# EasyEDA Pro project Robotic_Arm.eprj

# Schematic Schematic1
Board Name: Board1; Create Date: 2024-09-22
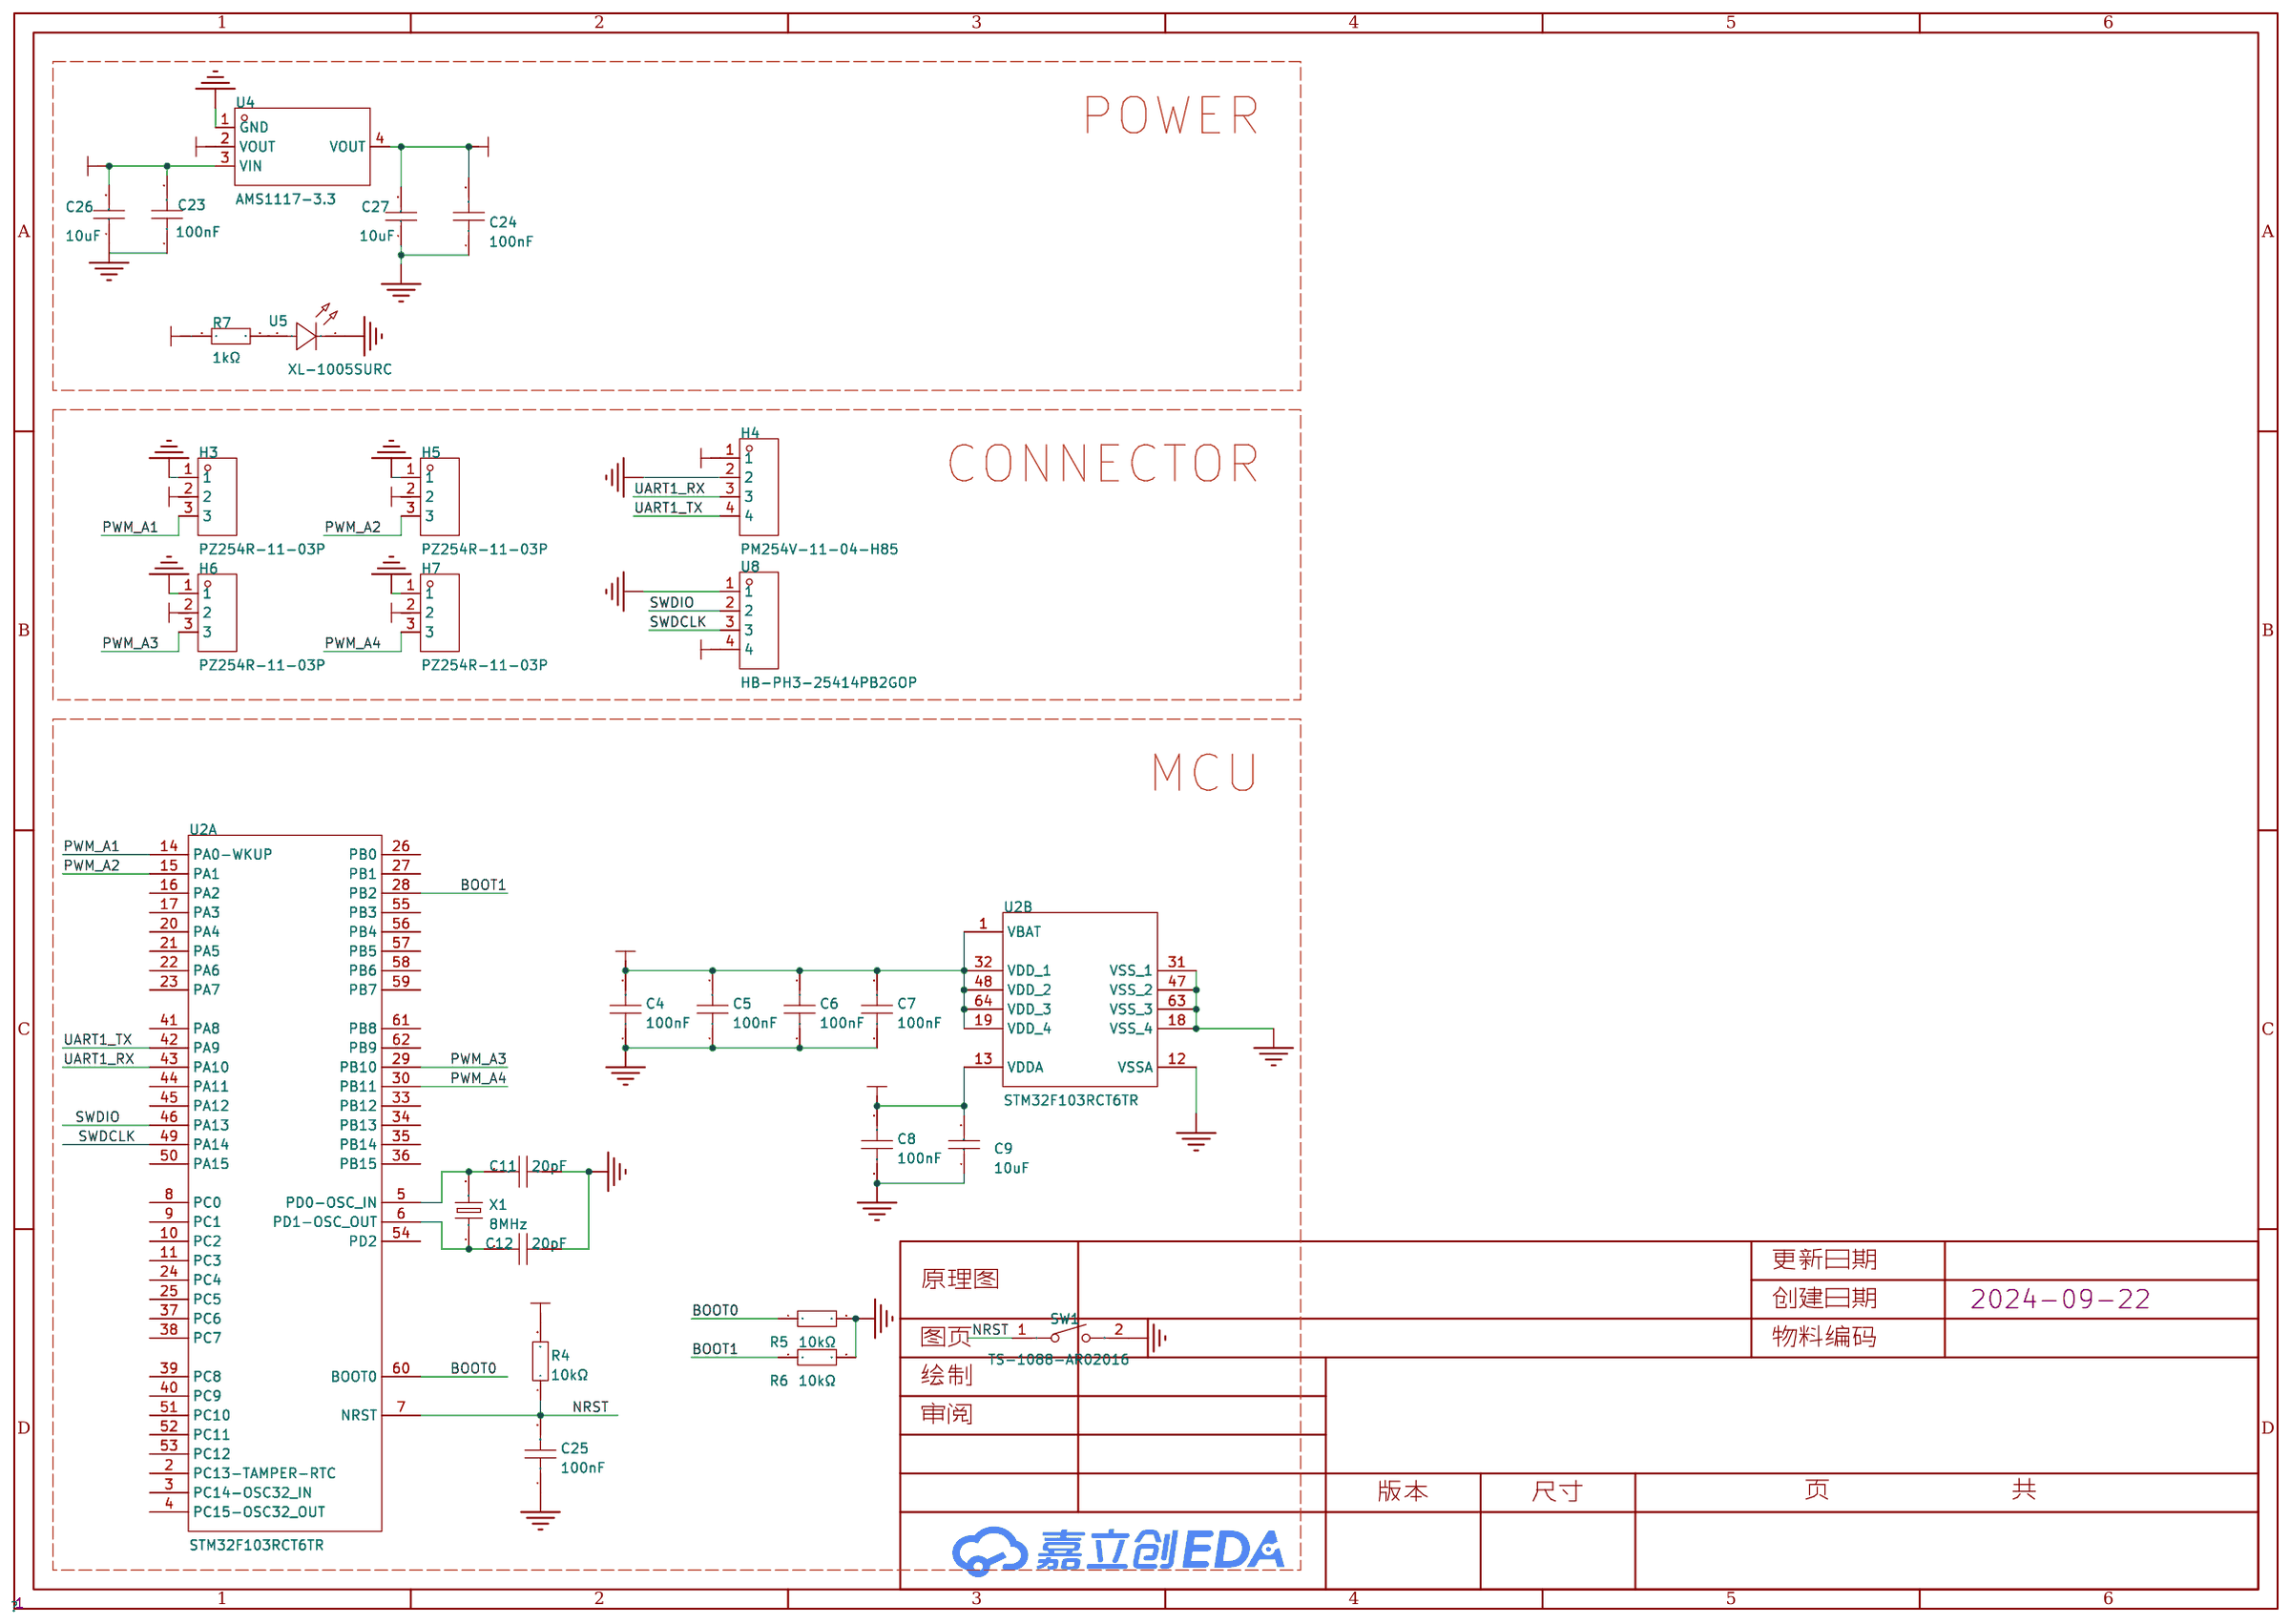
[diagram p0: schematic sheet]

## Parts
C4  100nF  [C0402]
C5  100nF  [C0402]
C6  100nF  [C0402]
C7  100nF  [C0402]
C8  100nF  [C0402]
C9  10uF  [C0402]
C11  20pF  [C0402]
C12  20pF  [C0402]
C23  100nF  [C0402]
C24  100nF  [C0402]
C25  100nF  [C0402]
C26  10uF  [C0402]
C27  10uF  [C0402]
H3  PZ254R-11-03P  [HDR-TH_3P-P2.54-H-M-W10.4]
H4  PM254V-11-04-H85  [HDR-TH_4P-P2.54-V-F]
H5  PZ254R-11-03P  [HDR-TH_3P-P2.54-H-M-W10.4]
H6  PZ254R-11-03P  [HDR-TH_3P-P2.54-H-M-W10.4]
H7  PZ254R-11-03P  [HDR-TH_3P-P2.54-H-M-W10.4]
R4  10kΩ  [R0402]
R5  10kΩ  [R0402]
R6  10kΩ  [R0402]
R7  1kΩ  [R0402]
SW1  TS-1088-AR02016  [SW-SMD_L3.9-W3.0-P4.45]
U2  STM32F103RCT6TR  [LQFP-64_L10.0-W10.0-P0.50-LS12.0-BL]  (sections 1,2)
U4  AMS1117-3.3  [SOT-223-3_L6.5-W3.4-P2.30-LS7.0-BR]
U5  XL-1005SURC  [LED0402-RD]
U8  HB-PH3-25414PB2GOP  [HDR-TH_4P-P2.54-V-M]
X1  8MHz  [HC-49US_L11.5-W4.5-P4.88]

## Library data of the parts
C4-C8 C25 = GRM155R71H104KE14D: 容值:100nF;精度:±10%;额定电压:50V;材质(温度系数):X7R;; LCSC Part Name: 100nF ±10% 50V; Supplier Part: C77020; Manufacturer: muRata(村田); Supplier Footprint: 0402; JLCPCB Part Class: 扩展库; Datasheet: https://atta.szlcsc.com/upload/public/pdf/source/20180326/C77020_39BD49C951FF1AF0DB1F1FAC5AC1E401.pdf; Supplier: LCSC; Tolerance: ±10%; Voltage Rated: 50V; Temperature Coefficient: X7R
C9 C26 C27 = CL05A106MQ5NUNC: 容值:10uF;精度:±20%;额定电压:6.3V;材质(温度系数):X5R;; LCSC Part Name: 10uF ±20% 6.3V; Supplier Part: C15525; Manufacturer: SAMSUNG(三星); Supplier Footprint: 0402; JLCPCB Part Class: 基础库; Datasheet: https://atta.szlcsc.com/upload/public/pdf/source/20220823/2B02EE04F8F211D38A52DCB16EB6BEBA.pdf; Supplier: LCSC; Tolerance: ±20%; Voltage Rated: 6.3V; Temperature Coefficient: X5R
C11 C12 = GRM1555C1H200JA01D: 容值:20pF;精度:±5%;额定电压:50V;材质(温度系数):C0G;; LCSC Part Name: 20pF ±5% 50V; Supplier Part: C76959; Manufacturer: muRata(村田); Supplier Footprint: 0402; JLCPCB Part Class: 扩展库; Datasheet: https://atta.szlcsc.com/upload/public/pdf/source/20180307/C76959_15204091273971407747.pdf; Supplier: LCSC; Tolerance: ±5%; Voltage Rated: 50V; Temperature Coefficient: C0G
C23 C24 = CC0402KRX7R7BB104: 容值:100nF;精度:±10%;额定电压:16V;材质(温度系数):X7R;; LCSC Part Name: 100nF ±10% 16V; Supplier Part: C60474; Manufacturer: YAGEO(国巨); Supplier Footprint: 0402; JLCPCB Part Class: 扩展库; Datasheet: https://atta.szlcsc.com/upload/public/pdf/source/20211223/9278FD768280B81DDBEF48FA36411A03.pdf; Supplier: LCSC; Tolerance: ±10%; Voltage Rated: 16V; Temperature Coefficient: X7R
H3 H5-H7 = PZ254R-11-03P: LCSC Part Name: 间距:2.54mm 1x3P 弯插 方针; Supplier Part: C492411; Manufacturer: XFCN(兴飞); Supplier Footprint: 弯插,P=2.54mm; JLCPCB Part Class: 扩展库; Datasheet: https://atta.szlcsc.com/upload/public/pdf/source/20200309/C492411_5256E8AAA7569F6D33B6ADBFAE4F2888.pdf; Supplier: LCSC; Pin Structure: 1x3P; Pitch: 2.54mm; Circluar Pins/Square Pins: 方针; Mounting Type: 弯插; Number of Rows: 单排; Number of Pins: 3P; Length of Mating Pin: 6mm; Insulation Height: 2.5mm; Contact Material: 黄铜; Operating Temperature Range: -40℃~+105℃; Color: 黑色
H4 = PM254V-11-04-H85: LCSC Part Name: 间距:2.54mm 1x4P 直插; Supplier Part: C541851; Manufacturer: XFCN(兴飞); Supplier Footprint: 插件,P=2.54mm; JLCPCB Part Class: 扩展库; Datasheet: https://atta.szlcsc.com/upload/public/pdf/source/20200518/C541849_85853D71FC67C51915A806977A588FDA.pdf; Supplier: LCSC; Holes Structure: 1x4P; Pitch: 2.54mm; Mounting Type: 直插; Number of Rows: 单排; Number of Holes: 4P; Contact Material: 黄铜
R4-R6 = RC0402FR-0710KL: 电阻类型:厚膜电阻;阻值:10kΩ;精度:±1%;功率:62.5mW;最大工作电压:50V;温度系数:±100ppm/℃;; LCSC Part Name: 厚膜电阻 10kΩ ±1% 62.5mW; Supplier Part: C60490; Manufacturer: YAGEO(国巨); Supplier Footprint: 0402; JLCPCB Part Class: 扩展库; Datasheet: https://atta.szlcsc.com/upload/public/pdf/source/20170925/C131467_1506321478108990263.pdf; Supplier: LCSC; Type: 厚膜电阻; Tolerance: ±1%; Power(Watts): 62.5mW; Overload Voltage (Max): 50V; Temperature Coefficient: ±100ppm/℃; Operating Temperature Range: -55℃~+155℃
R7 = 0402WGF1001TCE: LCSC Part Name: 1kΩ ±1% 62.5mW 厚膜电阻; Supplier Part: C11702; Manufacturer: UNI-ROYAL(厚声); Supplier Footprint: 0402; JLCPCB Part Class: 基础库; Datasheet: https://atta.szlcsc.com/upload/public/pdf/source/20200306/C422600_1E6D84923E4A46A82E41ADD87F860B5C.pdf; Supplier: LCSC; Type: 厚膜电阻; Tolerance: ±1%; Power(Watts): 62.5mW; Overload Voltage (Max): 50V; Temperature Coefficient: ±100ppm/℃; Operating Temperature Range: -55℃~+155℃
SW1 = TS-1088-AR02016: 电路结构:单刀单掷;按钮形状:圆形按钮;作用力:160gf;安装方式:立贴;开关长度:4mm;开关宽度:3mm;开关高度:2mm;带支架:不带;触点电流:50mA;额定电压(DC):12V;绝缘电阻:100MΩ;机械寿命:10万次;; LCSC Part Name: 4*3*2mm 立贴 轻触开关; Supplier Part: C720477; Manufacturer: XUNPU(讯普); Supplier Footprint: SMD; JLCPCB Part Class: 扩展库; Datasheet: https://atta.szlcsc.com/upload/public/pdf/source/20200810/C720475_60D09DD6C54279ADDB2DC25100F1CC11.pdf; Supplier: LCSC; Circuit: 单刀单掷; Actuator Style: 圆形按钮; Operating Force: 160gf; Mounting Style: 立贴; Switch Length: 4mm; Switch Width: 3mm; Switch Height: 2mm; Strike Gundam: 不带; Contact Current: 50mA; Voltage Rating (DC): 12V; Insulation Resistance: 100MΩ; Actuator/Cap Color: 黑色; Pin Style: SMD接片; Mechanical Life: 10万次; Operating Temperature: -30℃~+80℃
U2 = STM32F103RCT6TR: CPU内核:ARM-M3;程序存储容量:256KB;RAM总容量:48KB;GPIO端口数量:51;工作电压范围:2V~3.6V;CPU最大主频:72MHz;程序存储器类型:FLASH;; LCSC Part Name: 主流增强型ARM Cortex-M3 MCU，具有256 KB Flash、72 MHz CPU、电机控制、USB和CAN; Supplier Part: C39704; Manufacturer: ST(意法半导体); Supplier Footprint: LQFP-64(10x10); JLCPCB Part Class: 扩展库; Datasheet: https://atta.szlcsc.com/upload/public/pdf/source/20151012/1457707442737.pdf; Supplier: LCSC; CPU Core: ARM-M3; Program Storage Size: 256KB; RAM Size: 48KB; GPIO Ports Number: 51; Operating Voltage Range: 2V~3.6V; CPU Maximum Speed: 72MHz; Program Memory Type: FLASH; Operating Temperature Range: -40℃~+85℃; ADC (Bit): 12bit; DAC (Bit): 12bit; Universal Serial Bus: 有; Peripheral/Function: 看门狗；DMA；看门狗；温度传感器; Watchdog: 有; Infrared Data Association: 有; Low-Voltage Detect: 有; Direct Memory Access: 有; Internal Oscillator: 有
U4 = AMS1117-3.3_C6186: 输出类型:固定;最大输入电压:-;输出电压:3.3V;最大输出电流:1A;电源纹波抑制比(PSRR):72dB@(120Hz);输出极性:正极;; LCSC Part Name: 输出3.3V 1A; Supplier Part: C6186; Manufacturer: AMS; Supplier Footprint: SOT-223; JLCPCB Part Class: 基础库; Datasheet: https://atta.szlcsc.com/upload/public/pdf/source/20180727/C6186_7A095716F0823C02F1997A905E26C086.pdf; Supplier: LCSC; Output Type: 固定; Output Voltage: 3.3V; MAX Output Current: 1A; Power Supply Rejection Ratio (PSRR): 72dB@(120Hz); Dropout Voltage: 1.3V@(800mA); Output Polarity: 正极; Number of Outputs: 1
U5 = XL-1005SURC_1: Supplier Part: C25503345; Manufacturer: XINGLIGHT(成兴光); Supplier Footprint: 0402; JLCPCB Part Class: 扩展库; Datasheet: https://atta.szlcsc.com/upload/public/pdf/source/20240704/9C7261DCC069C62DE8B89DB3AF7BA4C4.pdf; Supplier: LCSC
U8 = HB-PH3-25414PB2GOP: 插针结构:1x4P;间距:2.54mm;行距:2.54mm;圆针/方针:方针;安装类型:直插;排数:单排;总PIN位数:4P;额定电流:3A;额定电压:250V;配合针长度:6mm;塑高:2.54mm;端接针长度:3mm;触头材质:黄铜;触头镀层:金;工作温度范围:-40℃~+105℃;焊接温度(最大值):260℃;颜色:黑色;; LCSC Part Name: 间距:2.54mm 1x4P 直插 方针; Supplier Part: C6332197; Manufacturer: HANBO(汉博); Supplier Footprint: 插件,P=2.54mm; JLCPCB Part Class: 扩展库; Datasheet: https://atta.szlcsc.com/upload/public/pdf/source/20230803/F72D259687963761DF1B552F3BB84A31.pdf; Supplier: LCSC; Pin Structure: 1x4P; Pitch: 2.54mm; Row Spacing: 2.54mm; Circluar Pins/Square Pins: 方针; Mounting Type: 直插; Number of Rows: 单排; Number of Pins: 4P; Current Rating (Max): 3A; Voltage Rating (Max): 250V; Length of Mating Pin: 6mm; Insulation Height: 2.54mm; Length of End Connection Pin: 3mm; Contact Material: 黄铜; Contact Plating: 金; Operating Temperature Range: -40℃~+105℃; Soldering Temperature(Max): 260℃; Color: 黑色
X1 = 49S-8.000-20-20-20/A: 晶振类型:直插晶振;频率:8MHz;常温频差:±20ppm;外接负载电容:20pF;频率稳定度(全温):±20ppm;; LCSC Part Name: 8MHz ±20ppm 20pF; Supplier Part: C240916; Manufacturer: LIMING(利明); Supplier Footprint: HC-49S; JLCPCB Part Class: 扩展库; Datasheet: https://atta.szlcsc.com/upload/public/pdf/source/20180930/C240954_D21D826943E58A9880472B1227802F84.pdf; Supplier: LCSC; Crystal Type: 直插晶振; Normal temperature Frequency Tolerance: ±20ppm; External load capacitor: 20pF; Frequency Stability(Full temperature range): ±20ppm; Operating Temperature: -20℃~+70℃

## Nets
3V3: C4.2 C5.2 C6.2 C7.2 C8.2 C9.2 C24.2 C27.2 R4.2 R7.1 U2.1(VBAT) U2.13(VDDA) U2.19(VDD_4) U2.32(VDD_1) U2.48(VDD_2) U2.64(VDD_3) U4.2(VOUT) U4.4(VOUT) U8.4
5V: C23.2 C26.2 H3.2 H4.1 H5.2 H6.2 H7.2 U4.3(VIN)
GND: C4.1 C5.1 C6.1 C7.1 C8.1 C9.1 C11.2 C12.2 C24.1 C25.1 C26.1 C27.1 H3.1 H4.2 H5.1 H6.1 H7.1 R5.2 R6.2 SW1.2 U2.12(VSSA) U2.18(VSS_4) U2.31(VSS_1) U2.47(VSS_2) U2.63(VSS_3) U4.1(GND) U5.1(K) U8.1
BOOT0: R5.1 U2.60(BOOT0)
BOOT1: R6.1 U2.28(PB2)
NRST: C25.2 R4.1 SW1.1 U2.7(NRST)
PWM_A1: H3.3 U2.14(PA0-WKUP)
PWM_A2: H5.3 U2.15(PA1)
PWM_A3: H6.3 U2.29(PB10)
PWM_A4: H7.3 U2.30(PB11)
SWDCLK: U2.49(PA14) U8.3
SWDIO: U2.46(PA13) U8.2
UART1_RX: H4.3 U2.43(PA10)
UART1_TX: H4.4 U2.42(PA9)
$1N1963: C12.1 U2.6(PD1-OSC_OUT) X1.1
Net-(C11-1): C11.1 U2.5(PD0-OSC_IN) X1.2
Net-(R7-2): R7.2 U5.2(A)

Not connected (* = marked no-connect by the designer): C23 1; U2 2(PC13-TAMPER-RTC) 3(PC14-OSC32_IN) 4(PC15-OSC32_OUT) 8(PC0) 9(PC1) 10(PC2) 11(PC3) 16(PA2) 17(PA3) 20(PA4) 21(PA5) 22(PA6) 23(PA7) 24(PC4) 25(PC5) 26(PB0) 27(PB1) 33(PB12) 34(PB13) 35(PB14) 36(PB15) 37(PC6) 38(PC7) 39(PC8) 40(PC9) 41(PA8) 44(PA11) 45(PA12) 50(PA15) 51(PC10) 52(PC11) 53(PC12) 54(PD2) 55(PB3) 56(PB4) 57(PB5) 58(PB6) 59(PB7) 61(PB8) 62(PB9)

## Notes on the sheet
- POWER
- CONNECTOR
- MCU

# Board PCB1
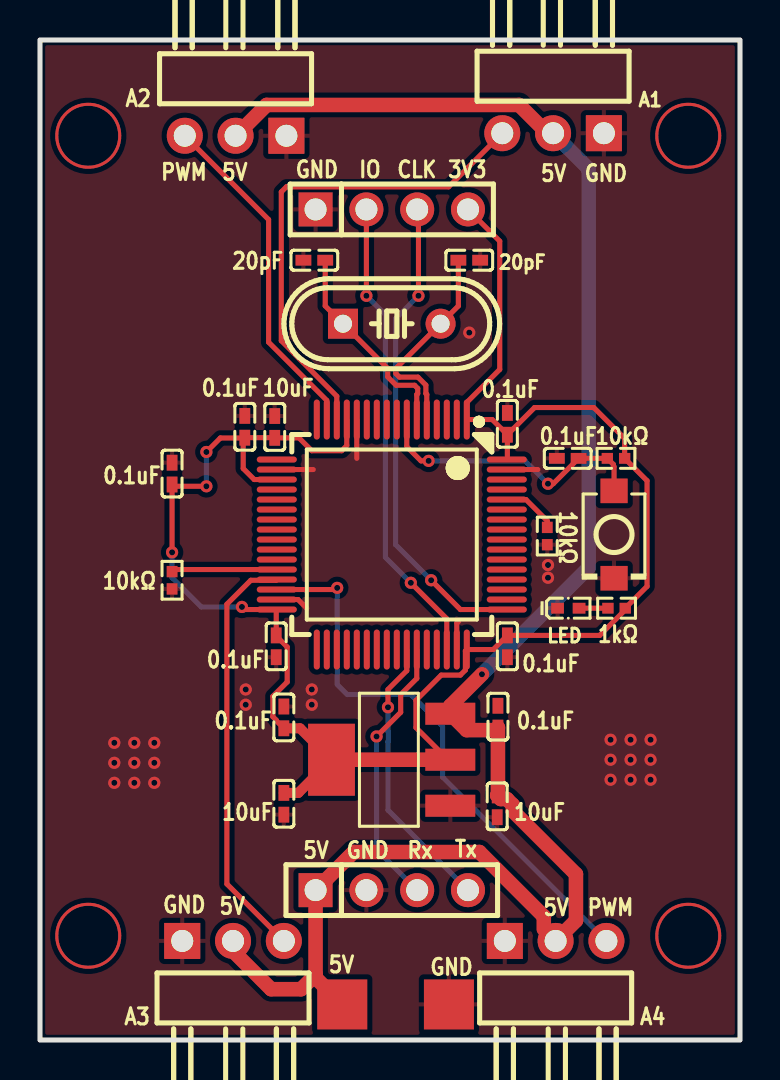
[diagram p1: board, top side]
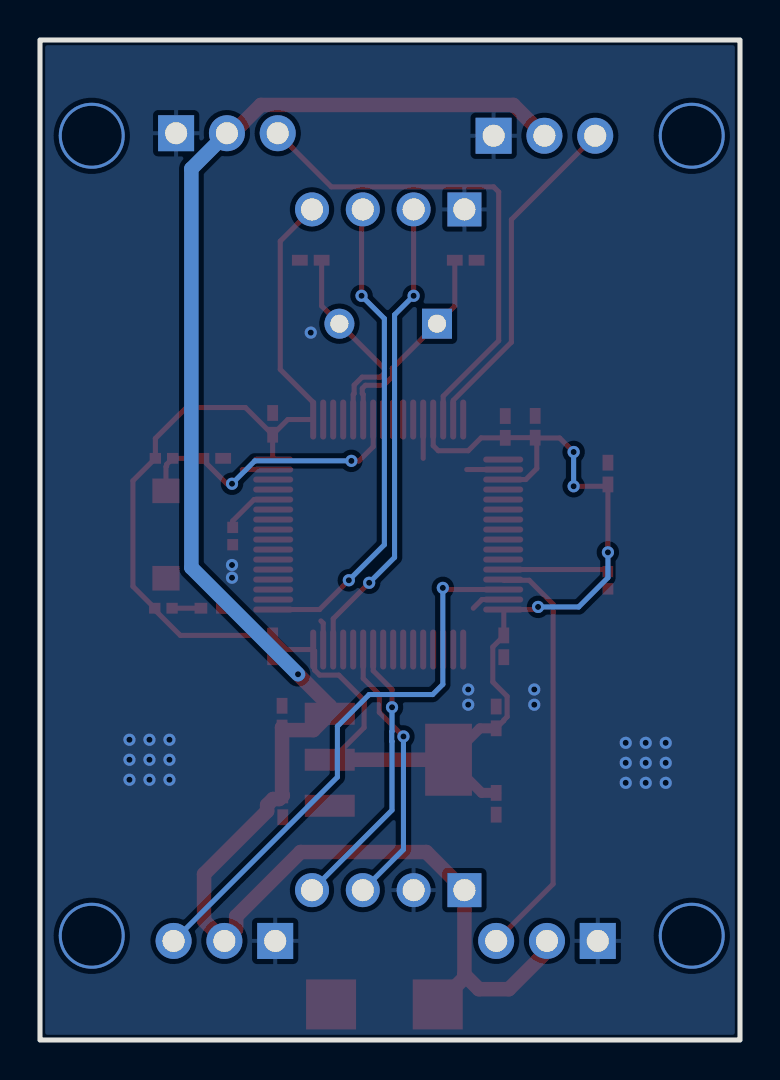
[diagram p2: board, bottom side, seen from below]

Outline 35 x 50 mm; copper layers: Top Layer, Bottom Layer. Coordinates in mm from the lower left corner of the outline.
Outline path: rectangle 0,50 35,0
Stack: Top Layer 0.035mm / Dielectric1 1.51mm FR4 er 4.5 / Bottom Layer 0.035mm

## Design rules (mm)
net $1N1962: DP1
net $1N1963: DP1
template: JLCPCB Capability(Two Layers Board)
spacing copperThickness1oz (default): track to track 0.102, other pairs 0.152 to 0.3
spacing copperThickness2oz: track to track 0.203, other pairs 0.152 to 0.3
track width copperThickness1oz (default): min 0.127, default 0.254, max 2.54
track width copperThickness2oz: min 0.203, default 0.254, max 2.54
differential pair differentialPair (default): width min 0.127, default 0.254, max 2.54; gap min 0.152, default 0.152
via viaSize (default): diameter min 0.5, default 0.61, max 10; hole min 0.3, default 0.305, max 6.3

## Placement (name value [footprint] x y rotation side)
20pF  20pF  [C0402]  21.46 38.99 0 top
A1  PZ254R-11-03P  [HDR-TH_3P-P2.54-H-M-W10.4]  25.65 45.34 180 top
C4  100nF  [C0402]  11.81 19.69 90 top
C5  100nF  [C0402]  23.37 19.69 90 top
C6  100nF  [C0402]  23.37 30.81 270 top
C7  100nF  [C0402]  6.6 28.32 270 top
C8  100nF  [C0402]  10.24 30.66 270 top
C9  10uF  [C0402]  11.74 30.65 270 top
C12  20pF  [C0402]  13.72 38.99 180 top
C23  100nF  [C0402]  22.9 16.17 270 top
C24  100nF  [C0402]  12.19 16.13 270 top
C25  100nF  [C0402]  26.39 29.08 0 top
C26  10uF  [C0402]  22.86 11.68 90 top
C27  10uF  [C0402]  12.19 11.81 90 top
H4  PM254V-11-04-H85  [HDR-TH_4P-P2.54-V-F]  17.59 7.49 0 top
H5  PZ254R-11-03P  [HDR-TH_3P-P2.54-H-M-W10.4]  9.78 45.21 180 top
H6  PZ254R-11-03P  [HDR-TH_3P-P2.54-H-M-W10.4]  9.65 4.95 0 top
H7  PZ254R-11-03P  [HDR-TH_3P-P2.54-H-M-W10.4]  25.78 4.95 0 top
LED  XL-1005SURC  [LED0402-RD]  26.42 21.59 0 top
NOREF  -  [Pad_e1258]  20.45 1.78 0 top
NOREF#2  -  [Pad_e1257]  15.11 1.78 0 top
R4  10kΩ  [R0402]  28.8 29.08 0 top
R5  10kΩ  [R0402]  25.37 25.2 270 top
R6  10kΩ  [R0402]  6.6 22.99 270 top
R7  1kΩ  [R0402]  28.83 21.59 180 top
SW1  TS-1088-AR02016  [SW-SMD_L3.9-W3.0-P4.45]  28.7 25.27 270 top
U2  STM32F103RCT6TR  [LQFP-64_L10.0-W10.0-P0.50-LS12.0-BL]  17.59 25.27 180 top
U4  AMS1117-3.3  [SOT-223-3_L6.5-W3.4-P2.30-LS7.0-BR]  17.54 14.01 0 top
U8  HB-PH3-25414PB2GOP  [HDR-TH_4P-P2.54-V-M]  17.59 41.53 0 top
X1  8MHz  [HC-49US_L11.5-W4.5-P4.88]  17.59 35.81 0 top

## Footprints (pads in the part's own frame, mm; a bottom-side part is the same pattern mirrored in y, then rotated)
C0402
  rect 0.79x0.54 smd: 1(-0.545,0) 2(0.545,0)
HC-49US_L11.5-W4.5-P4.88
  rect 1.5x1.5 hole 0.9: 1(-2.44,0)
  round 1.5 hole 0.9: 2(2.44,0)
HDR-TH_3P-P2.54-H-M-W10.4
  rect 1.8x1.8 hole 1.1: 1(-2.54,0)
  round 1.8 hole 1.1: 2(0,0) 3(2.54,0)
HDR-TH_4P-P2.54-V-F
  rect 1.7x1.7 hole 1.1: 1(-3.81,0)
  round 1.7 hole 1.1: 2(-1.27,0) 3(1.27,0) 4(3.81,0)
HDR-TH_4P-P2.54-V-M
  rect 1.7x1.7 hole 1.1: 1(-3.81,0)
  round 1.7 hole 1.1: 2(-1.27,0) 3(1.27,0) 4(3.81,0)
LED0402-RD
  rect 0.636x0.54 smd: 1(-0.538,0) 2(0.538,0)
LQFP-64_L10.0-W10.0-P0.50-LS12.0-BL
  oval 0.3x2 smd: 1(-3.75,-5.75) 2(-3.25,-5.75) 3(-2.75,-5.75) 4(-2.25,-5.75) 5(-1.75,-5.75) 6(-1.25,-5.75) 7(-0.75,-5.75) 8(-0.25,-5.75) 9(0.25,-5.75) 10(0.75,-5.75) 11(1.25,-5.75) 12(1.75,-5.75) 13(2.25,-5.75) 14(2.75,-5.75) 15(3.25,-5.75) 16(3.75,-5.75) 33(3.75,5.75) 34(3.25,5.75) 35(2.75,5.75) 36(2.25,5.75) 37(1.75,5.75) 38(1.25,5.75) 39(0.75,5.75) 40(0.25,5.75) 41(-0.25,5.75) 42(-0.75,5.75) 43(-1.25,5.75) 44(-1.75,5.75) 45(-2.25,5.75) 46(-2.75,5.75) 47(-3.25,5.75) 48(-3.75,5.75)
  oval 2x0.3 smd: 17(5.75,-3.75) 18(5.75,-3.25) 19(5.75,-2.75) 20(5.75,-2.25) 21(5.75,-1.75) 22(5.75,-1.25) 23(5.75,-0.75) 24(5.75,-0.25) 25(5.75,0.25) 26(5.75,0.75) 27(5.75,1.25) 28(5.75,1.75) 29(5.75,2.25) 30(5.75,2.75) 31(5.75,3.25) 32(5.75,3.75) 49(-5.75,3.75) 50(-5.75,3.25) 51(-5.75,2.75) 52(-5.75,2.25) 53(-5.75,1.75) 54(-5.75,1.25) 55(-5.75,0.75) 56(-5.75,0.25) 57(-5.75,-0.25) 58(-5.75,-0.75) 59(-5.75,-1.25) 60(-5.75,-1.75) 61(-5.75,-2.25) 62(-5.75,-2.75) 63(-5.75,-3.25) 64(-5.75,-3.75)
Pad_e1257
  rect 2.5x2.5 smd: 1(0,0)
Pad_e1258
  rect 2.5x2.5 smd: 2(0,0)
R0402
  rect 0.566x0.54 smd: 1(-0.433,0) 2(0.433,0)
SOT-223-3_L6.5-W3.4-P2.30-LS7.0-BR
  rect 2.5x1.1 smd: 1(2.97,-2.3) 2(2.97,0) 3(2.97,2.3)
  rect 2.34x3.6 smd: 4(-2.97,0)
SW-SMD_L3.9-W3.0-P4.45
  rect 1.23x1.36 smd: 1(-2.185,0) 2(2.185,0)

## Nets
3V3: C4.2 C5.2 C6.2 C7.2 C8.2 C9.2 C24.2 C27.2 R4.2 R7.1 U2.1 U2.13 U2.19 U2.32 U2.48 U2.64 U4.2 U4.4 U8.4
5V: A1.2 C23.2 C26.2 H4.1 H5.2 H6.2 H7.2 NOREF#2.1 U4.3
GND: 20pF.2 A1.1 C4.1 C5.1 C6.1 C7.1 C8.1 C9.1 C12.2 C24.1 C25.1 C26.1 C27.1 H4.2 H5.1 H6.1 H7.1 LED.1 NOREF.2 R5.2 R6.2 SW1.2 U2.12 U2.18 U2.31 U2.47 U2.63 U4.1 U8.1
BOOT0: R5.1 U2.60
BOOT1: R6.1 U2.28
NRST: C25.2 R4.1 SW1.1 U2.7
PWM_A1: A1.3 U2.14
PWM_A2: H5.3 U2.15
PWM_A3: H6.3 U2.29
PWM_A4: H7.3 U2.30
SWDCLK: U2.49 U8.3
SWDIO: U2.46 U8.2
UART1_RX: H4.3 U2.43
UART1_TX: H4.4 U2.42
$1N1962: 20pF.1 U2.5 X1.2
$1N1963: C12.1 U2.6 X1.1
$1N1985: LED.2 R7.2
$1N1999: C23.1

Pads without a net: U2 2 3 4 8 9 10 11 16 17 20 21 22 23 24 25 26 27 33 34 35 36 37 38 39 40 41 44 45 50 51 52 53 54 55 56 57 58 59 61 62

## Via types
v1: diameter 3.3, hole 3, Top Layer to Bottom Layer, 4 vias
v2: diameter 0.61, hole 0.305, Top Layer to Bottom Layer, 39 vias

## Routing (per net, layer and track width the routed paths; a pad name or vN(x,y) marks a point on that pad's centre or on a via; arc(x,y) is an arc through that point)
3V3: length 93.8
  Top Layer w0.254: v2(6.6,24.38) C7.2 6.69,27.69 v2(8.32,27.69) ; U2.64 23.37,29.05 C6.2 ; 20.4,14.01 18.8,15.62 18.8,16.98 20.06,18.24 21.02,18.24 21.27,18.5 21.27,19.45 U2.48 22.66,19.52 C5.2 27.98,20.23 29.26,21.51 R7.1 30.35,22.68 30.35,27.96 R4.2 29.23,30.08 27.69,31.62 24.73,31.62 C6.2 ; U2.19 10.71,28.02 10.16,28.58 10.16,30.03 10.22,30.1 ; C6.2 22.61,31.02 U2.1 21.34,31.88 22.99,33.53 22.99,39.94 U8.4 ; U2.13 15.34,29.72 15.09,29.46 13.59,29.46 12.94,30.11 C9.2 11.73,30.12 C8.2 10.22,30.1 ; 10.22,30.1 9.02,30.1 v2(8.32,29.4) ; v2(10.1,21.65) 10.23,21.52 U2.32 11.81,21.49 C4.2 11.81,20.2 12.36,19.65 12.36,17.9 11.64,17.18 11.64,16.16 11.81,16 11.81,15.97 C24.2
  Top Layer w0.5: C27.2 12.92,12.36 U4.4 13,15.58 C24.2
  Top Layer w0.724: U4.2 U4.4
  Bottom Layer w0.254: v2(8.32,29.4) v2(8.32,27.69) ; v2(6.6,24.38) 6.6,23.11 8.06,21.65 v2(10.1,21.65)
5V: length 91.6
  Top Layer w0.724: H7.2 26.8,5.97 26.8,8.29 23.64,11.44 23.64,11.75 23.34,12.05 23.04,12.05 C26.2 22.9,12.27 C23.2 22.77,15.49 21.33,15.49 U4.3 20.51,16.7 v2(22.1,18.29) ; 25.19,5.54 25.19,6.18 21.97,9.4 15.68,9.4 H4.1 13.78,3.26 ; H5.2 9.79,45.21 11.33,46.75 23.95,46.75 25.37,45.34 A1.2 ; H6.2 9.65,4.44 11.56,2.54 13.06,2.54 13.78,3.26 ; NOREF#2.1 13.78,3.11 13.78,3.26
  Bottom Layer w0.724: v2(22.1,18.29) 27.43,23.62 27.43,43.56 A1.2
GND: length 8.5
  Top Layer w0.254: 20.96,20.95 20.84,20.84 U2.47 ; 13.34,21.59 12.9,22.02 U2.31 ; U2.18 13.66,28.52 ; U2.12 15.84,29.08 ; U2.63 24.89,28.52
  vias: v2(3.71,14.86) v2(3.71,13.86) v2(3.71,12.86) v2(4.71,14.86) v2(4.71,13.86) v2(4.71,12.86) v2(5.71,14.86) v2(5.71,13.86) v2(5.71,12.86) v2(10.29,17.53) v2(10.29,16.76) v2(13.59,17.53) v2(13.59,16.76) v2(21.46,35.37) v2(25.4,23.75) v2(25.4,23.11) v2(28.53,15.01) v2(28.53,14.01) v2(28.53,13.01) v2(29.53,15.01) v2(29.53,14.01) v2(29.53,13.01) v2(30.53,15.01) v2(30.53,14.01) v2(30.53,13.01)
(no net):
  vias: v1(2.41,45.21) v1(2.41,5.21) v1(32.41,45.21) v1(32.41,5.21)
BOOT0: length 2.8
  Top Layer w0.254: U2.60 24.3,27.02 25.37,25.95 R5.1
BOOT1: length 5.3
  Top Layer w0.254: R6.1 6.71,23.52 U2.28
NRST: length 14.4
  Top Layer w0.254: v2(25.4,27.81) 25.66,27.81 C25.2 28.37,29.08 28.67,28.78 28.67,28.7 28.7,28.67 SW1.1 ; U2.7 18.34,29.67 19.05,28.96 v2(19.43,28.96)
  Bottom Layer w0.254: v2(25.4,27.81) 24.26,28.96 v2(19.43,28.96)
PWM_A1: length 24.8
  Top Layer w0.254: U2.14 14.84,32.19 12.06,34.96 12.06,42.4 12.32,42.66 20.43,42.66 A1.3
PWM_A2: length 17.1
  Top Layer w0.254: H5.3 11.43,41.02 11.43,34.89 14.34,31.98 U2.15
PWM_A3: length 21
  Top Layer w0.254: H6.3 9.35,7.8 9.35,21.79 10.54,22.99 11.8,22.99 U2.29
PWM_A4: length 28.1
  Top Layer w0.254: U2.30 14.78,22.52 v2(14.86,22.61)
  Bottom Layer w0.254: H7.3 20.13,13.14 20.13,15.68 18.54,17.27 15.37,17.27 14.86,17.78 v2(14.86,22.61)
SWDCLK: length 24.2
  Top Layer w0.254: U2.49 21.02,21.52 v2(19.56,22.99) ; v2(18.92,37.21) 18.92,41.47 U8.3
  Bottom Layer w0.254: v2(18.92,37.21) 17.78,36.07 17.78,24.77 v2(19.56,22.99)
SWDIO: length 23.7
  Top Layer w0.254: U2.46 20.34,21.06 v2(18.54,22.86) ; U8.2 v2(16.32,37.21)
  Bottom Layer w0.254: v2(18.54,22.86) 17.27,24.13 17.27,36.26 v2(16.32,37.21)
UART1_RX: length 13.7
  Top Layer w0.254: v2(16.83,15.18) 18.03,16.38 18.03,17.27 18.84,18.08 U2.43
  Bottom Layer w0.254: v2(16.83,15.18) 16.83,9.53 H4.3
UART1_TX: length 14.1
  Top Layer w0.254: v2(17.4,16.64) 17.4,17.53 18.34,18.47 U2.42
  Bottom Layer w0.254: v2(17.4,16.64) 17.4,15.43 17.41,15.42 17.41,14.93 17.4,14.92 17.4,11.49 H4.4
$1N1962: length 10.4
  Top Layer w0.254: U2.5 19.34,32.28 19.29,32.32 19.29,32.75 18.9,33.14 17.97,33.14 17.79,33.32 17.79,33.58 X1.2 20.92,36.7 20pF.1
$1N1963: length 10.4
  Top Layer w0.254: C12.1 14.26,36.7 X1.1 17.39,33.58 17.39,33.16 17.8,32.74 18.73,32.74 18.89,32.58 18.89,32.32 18.84,32.28 U2.6
$1N1985: length 1.4
  Top Layer w0.254: LED.2 R7.2

## Copper pours and planes (outline as drawn; the poured copper is in the pictures)
GND on Top Layer: -9.65,60.96 42.54,60.96 42.54,-10.41 -9.65,-10.41
GND on Bottom Layer: -9.65,60.71 42.67,60.71 42.67,-10.41 -9.65,-10.41

## Text on the board
Top Silkscreen Layer: GND | 20pF | 5V | IO | CLK | Rx | 3V3 | Tx | A3 | A2 | PWM | A4 | 10kΩ | 0.1uF | 10uF | 1kΩ
